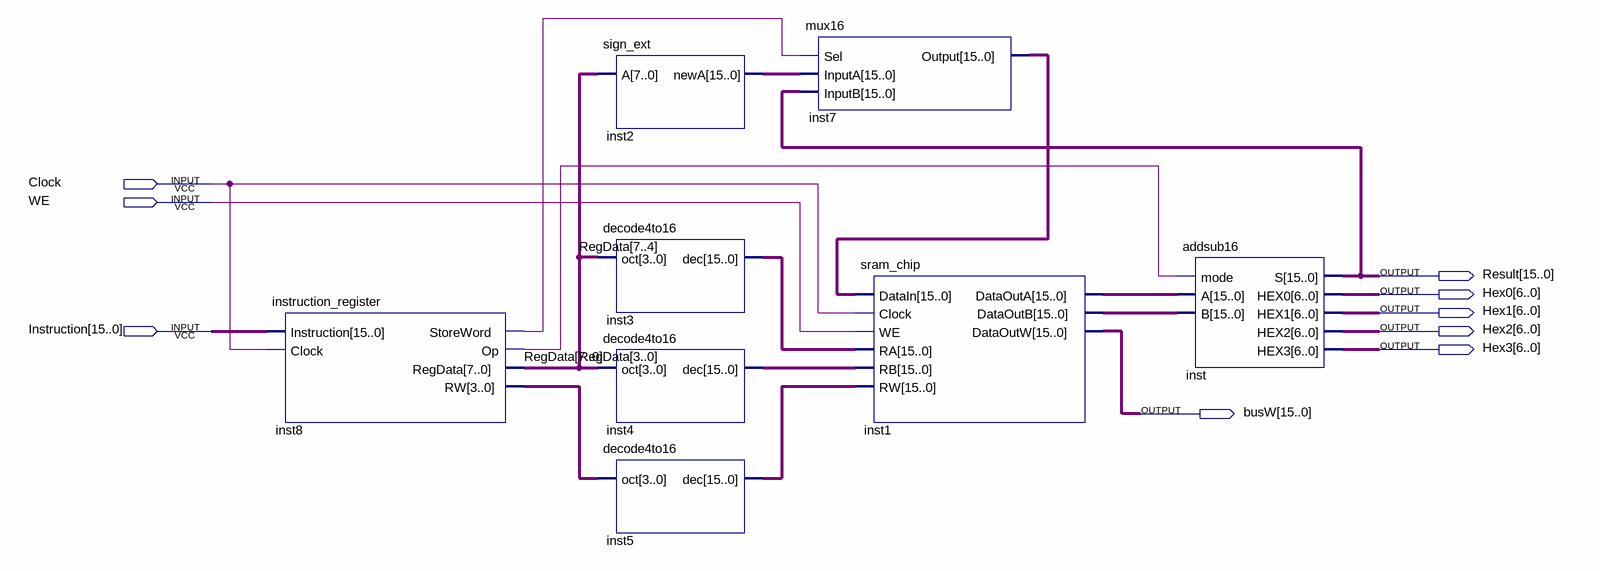
[diagram p0: schematic sheet]
// Quartus schematic CPU.bdf as structural Verilog: 8 symbols, 9 pins
module CPU (
  input  Clock,
  input  WE,
  input  [15:0] Instruction,
  output [15:0] Result,
  output [6:0] Hex0,
  output [6:0] Hex1,
  output [6:0] Hex2,
  output [6:0] Hex3,
  output [15:0] busW
);

  wire inst8_op, inst8_storeword;
  wire [3:0] inst8_rw;
  wire [7:0] RegData;
  wire [15:0] inst1_dataouta, inst1_dataoutb, inst2_newa, inst3_dec, inst4_dec, inst5_dec, inst7_output;

  instruction_register inst8 (
    .Instruction(Instruction), .Clock(Clock), .StoreWord(inst8_storeword), .Op(inst8_op), .RegData(RegData),
    .RW(inst8_rw));
  sign_ext inst2 (.A(RegData), .newA(inst2_newa));
  decode4to16 inst3 (.oct(RegData[7:4]), .dec(inst3_dec));
  decode4to16 inst4 (.oct(RegData[3:0]), .dec(inst4_dec));
  decode4to16 inst5 (.oct(inst8_rw), .dec(inst5_dec));
  mux16 inst7 (.Sel(inst8_storeword), .InputA(inst2_newa), .InputB(Result), .Output(inst7_output));
  sram_chip inst1 (
    .DataIn(inst7_output), .Clock(Clock), .WE(WE), .RA(inst3_dec), .RB(inst4_dec), .RW(inst5_dec),
    .DataOutA(inst1_dataouta), .DataOutB(inst1_dataoutb), .DataOutW(busW));
  addsub16 inst (
    .mode(inst8_op), .A(inst1_dataouta), .B(inst1_dataoutb), .S(Result), .HEX0(Hex0), .HEX1(Hex1),
    .HEX2(Hex2), .HEX3(Hex3));
endmodule
